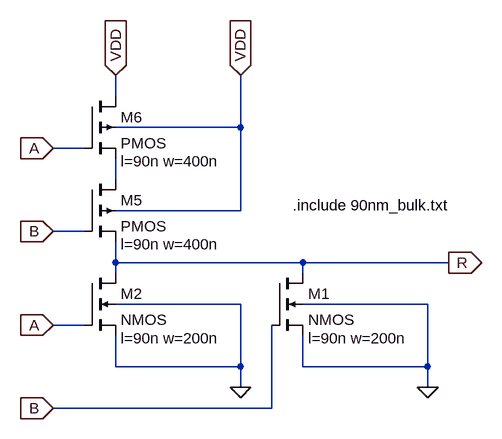
[diagram p0: schematic nor_gate.asc]
nor_gate.asc, the LTspice schematic file:
Version 4
SHEET 1 988 680
WIRE 320 -272 320 -304
WIRE 512 -224 512 -304
WIRE 512 -224 320 -224
WIRE 272 -192 224 -192
WIRE 320 -144 320 -176
WIRE 512 -96 512 -224
WIRE 512 -96 320 -96
WIRE 272 -64 224 -64
WIRE 320 -16 320 -48
WIRE 608 -16 320 -16
WIRE 832 -16 608 -16
WIRE 320 0 320 -16
WIRE 608 0 608 -16
WIRE 512 48 320 48
WIRE 800 48 608 48
WIRE 272 80 224 80
WIRE 320 144 320 96
WIRE 512 144 512 48
WIRE 512 144 320 144
WIRE 608 144 608 96
WIRE 800 144 800 48
WIRE 800 144 608 144
WIRE 512 176 512 144
WIRE 800 176 800 144
WIRE 560 208 560 80
WIRE 560 208 224 208
FLAG 224 80 A
IOPIN 224 80 In
FLAG 224 208 B
IOPIN 224 208 In
FLAG 832 -16 R
IOPIN 832 -16 Out
FLAG 512 176 0
FLAG 800 176 0
FLAG 224 -192 A
IOPIN 224 -192 In
FLAG 224 -64 B
IOPIN 224 -64 In
FLAG 320 -304 VDD
IOPIN 320 -304 In
FLAG 512 -304 VDD
IOPIN 512 -304 In
SYMBOL nmos4 272 0 R0
WINDOW 123 56 100 Left 2
SYMATTR Value2 l=90n w=200n
SYMATTR InstName M2
SYMBOL nmos4 560 0 R0
WINDOW 123 56 100 Left 2
SYMATTR Value2 l=90n w=200n
SYMATTR InstName M1
SYMBOL pmos4 272 -144 R0
WINDOW 123 56 100 Left 2
SYMATTR Value2 l=90n w=400n
SYMATTR InstName M5
SYMBOL pmos4 272 -272 R0
WINDOW 123 56 100 Left 2
SYMATTR Value2 l=90n w=400n
SYMATTR InstName M6
TEXT 592 -104 Left 2 !.include 90nm_bulk.txt

The netlist it stands for:
* nor_gate.asc
M2 R A 0 0 NMOS l=90n w=200n
M1 R B 0 0 NMOS l=90n w=200n
M5 N001 B R VDD PMOS l=90n w=400n
M6 VDD A N001 VDD PMOS l=90n w=400n
.model NMOS NMOS
.model PMOS PMOS
.lib standard.mos
.include 90nm_bulk.txt
.backanno
.end